# Altium schematic sheet XM5062_33.SchDoc
size 292 x 193 mm; Author: Power Lin; SheetNumber: 1; SheetTotal: 1; Website: wiki-power.com
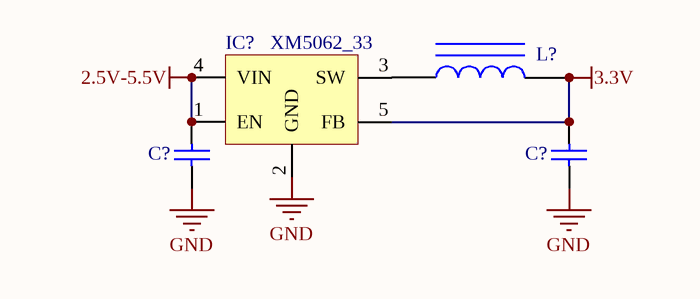
[diagram p0: XM5062_33.SchDoc]

## Parts
(Parts that share a designator on the sheet are numbered #1, #2 ... from top to bottom, then left to right.)
C?#1  4.7uF  [CAP-0603]  (value not drawn)
C?#2  10uF  [CAP-0603]  (value not drawn)
IC?  XM5062_33  [SOT-23-5]
L?  2.2uH  [XAL6060-103MEB]  (value not drawn)

## Nets
2.5V-5.5V: C?#1.2 IC?.1(EN) IC?.4(VIN)
3.3V: C?#2.2 IC?.5(FB) L?.2
GND: C?#1.1 C?#2.1 IC?.2(GND)
NetIC?_3: IC?.3(SW) L?.1

## Notes on the sheet
- Author
- DocumentName
- ModifiedDate
- ProjectName
- SheetNumber
- SheetTotal
- Website
- Revision

## Library data of the parts
C?#1 C?#2 = CAP: 贴片电容; ComponentLink1Description: 供应商链接; ComponentLink1URL: http://www.szlcsc.com/product/details_53938.html; Package: 0402; Supplier: LC; SuppliersPartNumber: C52923
IC? = XM5062: 降压转换芯片; Manufacturer_Name: TE Connectivity; Manufacturer_Part_Number: 1-1393258-5; Datasheet Link: http://www.te.com/commerce/DocumentDelivery/DDEController?Action=showdoc&DocId=Data+Sheet%7FSR2M%7F1116%7Fpdf%7FEnglish%7FENG_DS_SR2M_1116.pdf%7F1-1393258-5; Height: 25mm
L? = INDUCTOR: 贴片电感; ComponentLink1Description: 供应商链接; ComponentLink1URL: http://www.szlcsc.com/product/details_33003.html; Package: 0402; Supplier: LC; SuppliersPartNumber: C32041